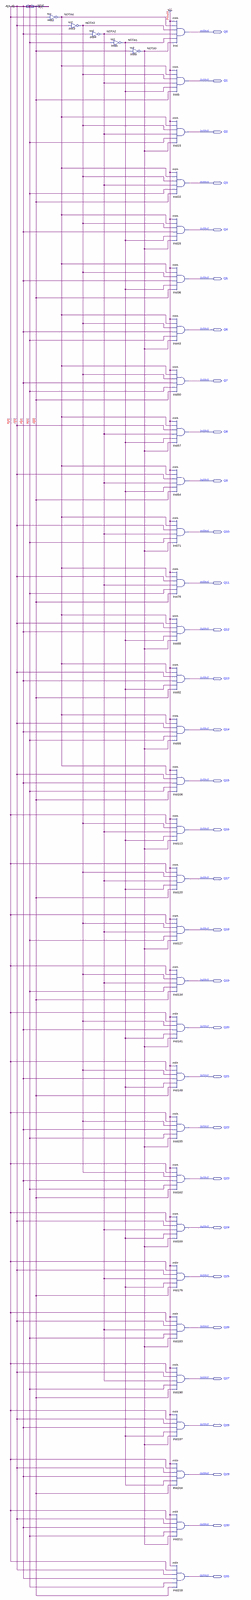
[diagram p0: schematic sheet, whole]
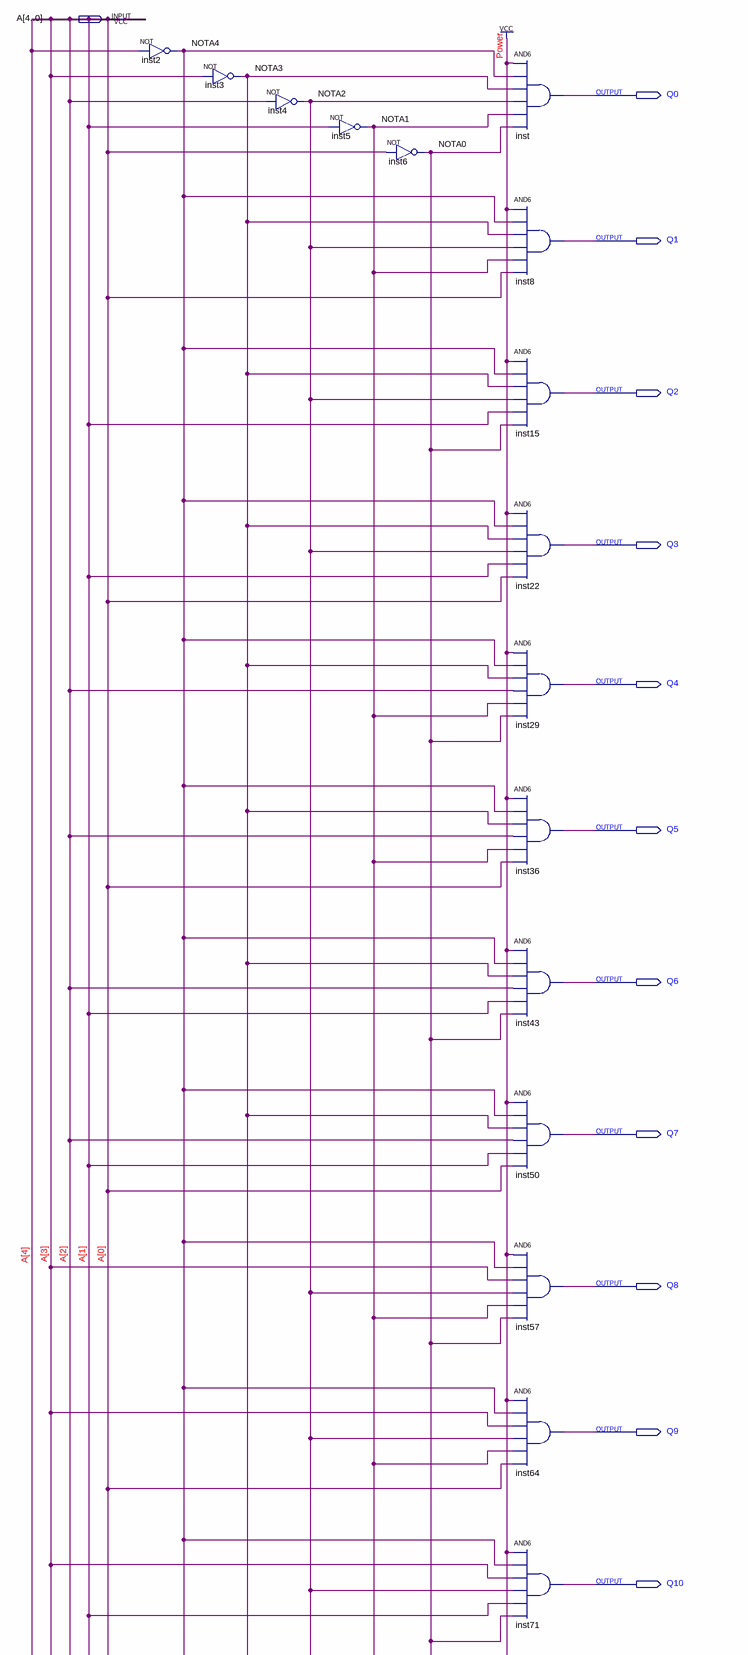
[diagram p1: schematic sheet, upper part]
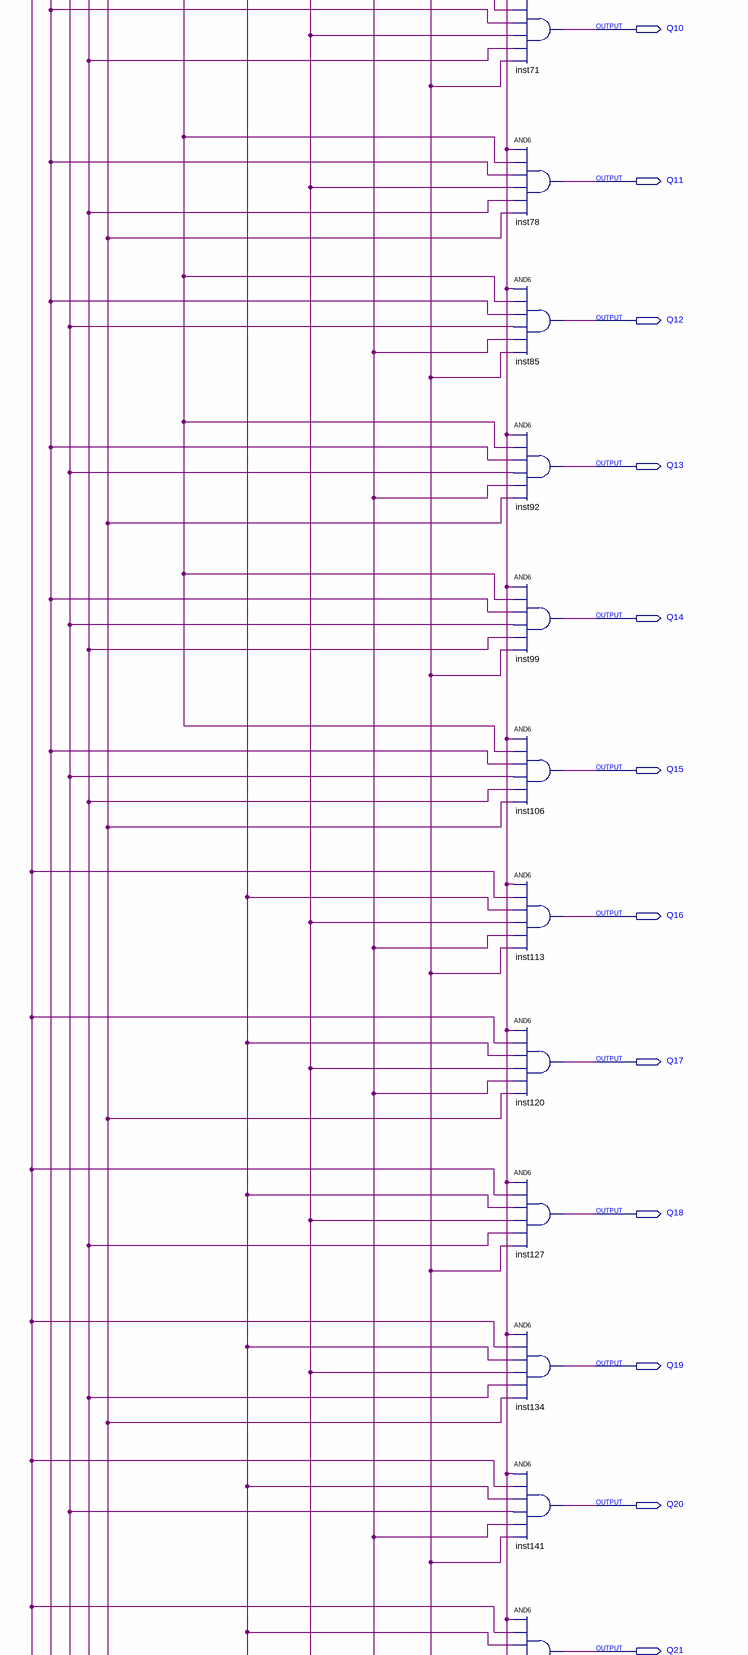
[diagram p2: schematic sheet, middle part]
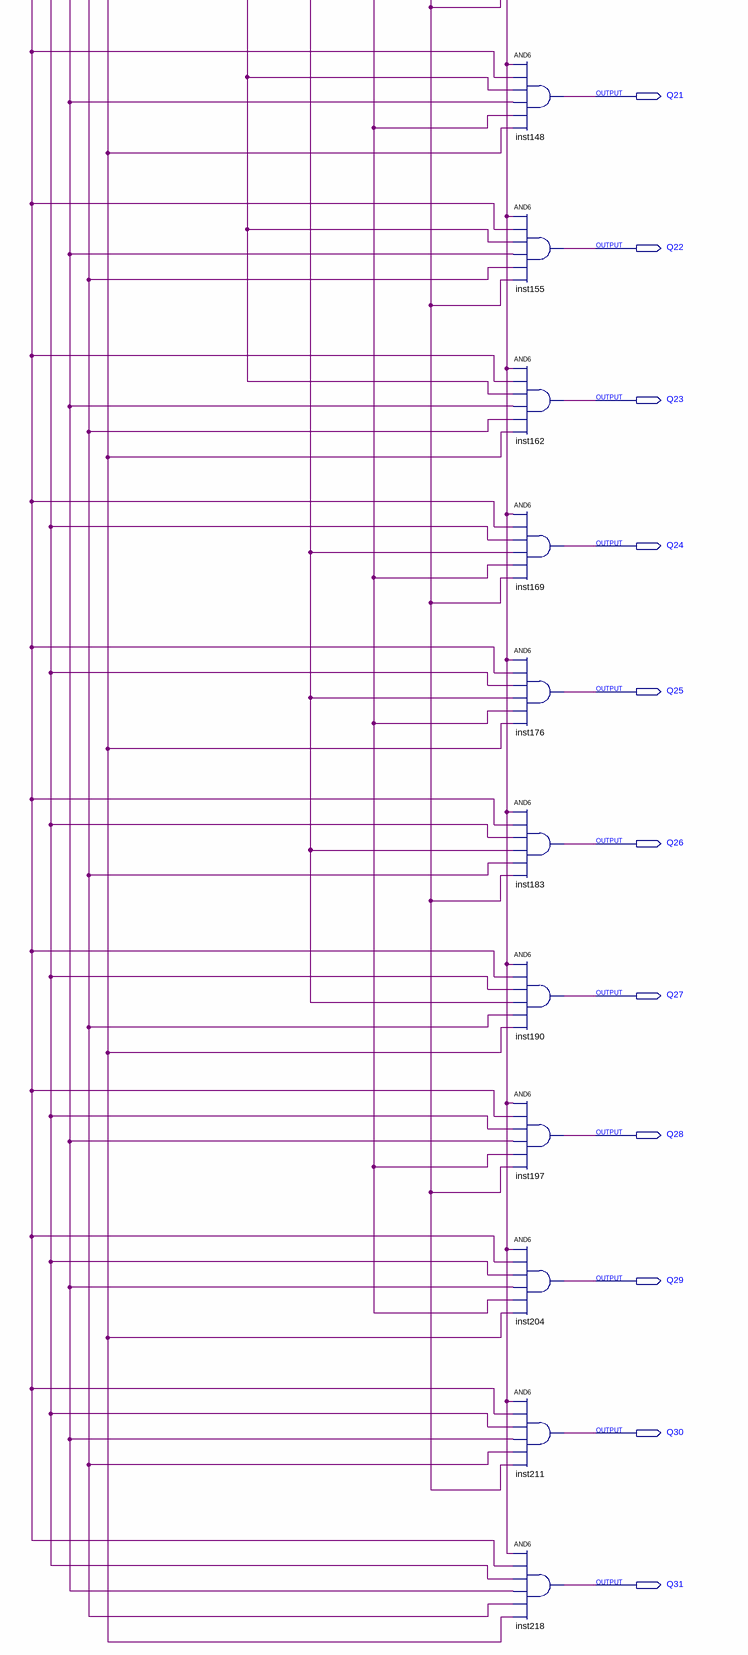
[diagram p3: schematic sheet, lower part]
// Quartus schematic Decoder_32.bdf as structural Verilog: 37 symbols, 33 pins
module Decoder_32 (
  input  [4:0] A,
  output Q0,
  output Q1,
  output Q2,
  output Q3,
  output Q4,
  output Q5,
  output Q6,
  output Q7,
  output Q8,
  output Q9,
  output Q10,
  output Q11,
  output Q12,
  output Q13,
  output Q14,
  output Q15,
  output Q16,
  output Q17,
  output Q18,
  output Q19,
  output Q20,
  output Q21,
  output Q22,
  output Q23,
  output Q24,
  output Q25,
  output Q26,
  output Q27,
  output Q28,
  output Q29,
  output Q30,
  output Q31
);

  wire NOTA0, NOTA1, NOTA2, NOTA3, NOTA4;

  not inst2 (NOTA4, A[4]);
  not inst3 (NOTA3, A[3]);
  not inst4 (NOTA2, A[2]);
  not inst5 (NOTA1, A[1]);
  not inst6 (NOTA0, A[0]);
  and inst (Q0, 1'b1, NOTA4, NOTA3, NOTA2, NOTA1, NOTA0);
  and inst8 (Q1, 1'b1, NOTA4, NOTA3, NOTA2, NOTA1, A[0]);
  and inst15 (Q2, 1'b1, NOTA4, NOTA3, NOTA2, A[1], NOTA0);
  and inst22 (Q3, 1'b1, NOTA4, NOTA3, NOTA2, A[1], A[0]);
  and inst29 (Q4, 1'b1, NOTA4, NOTA3, A[2], NOTA1, NOTA0);
  and inst36 (Q5, 1'b1, NOTA4, NOTA3, A[2], NOTA1, A[0]);
  and inst43 (Q6, 1'b1, NOTA4, NOTA3, A[2], A[1], NOTA0);
  and inst50 (Q7, 1'b1, NOTA4, NOTA3, A[2], A[1], A[0]);
  and inst57 (Q8, 1'b1, NOTA4, A[3], NOTA2, NOTA1, NOTA0);
  and inst64 (Q9, 1'b1, NOTA4, A[3], NOTA2, NOTA1, A[0]);
  and inst71 (Q10, 1'b1, NOTA4, A[3], NOTA2, A[1], NOTA0);
  and inst78 (Q11, 1'b1, NOTA4, A[3], NOTA2, A[1], A[0]);
  and inst85 (Q12, 1'b1, NOTA4, A[3], A[2], NOTA1, NOTA0);
  and inst92 (Q13, 1'b1, NOTA4, A[3], A[2], NOTA1, A[0]);
  and inst99 (Q14, 1'b1, NOTA4, A[3], A[2], A[1], NOTA0);
  and inst106 (Q15, 1'b1, NOTA4, A[3], A[2], A[1], A[0]);
  and inst113 (Q16, 1'b1, A[4], NOTA3, NOTA2, NOTA1, NOTA0);
  and inst120 (Q17, 1'b1, A[4], NOTA3, NOTA2, NOTA1, A[0]);
  and inst127 (Q18, 1'b1, A[4], NOTA3, NOTA2, A[1], NOTA0);
  and inst134 (Q19, 1'b1, A[4], NOTA3, NOTA2, A[1], A[0]);
  and inst141 (Q20, 1'b1, A[4], NOTA3, A[2], NOTA1, NOTA0);
  and inst148 (Q21, 1'b1, A[4], NOTA3, A[2], NOTA1, A[0]);
  and inst155 (Q22, 1'b1, A[4], NOTA3, A[2], A[1], NOTA0);
  and inst162 (Q23, 1'b1, A[4], NOTA3, A[2], A[1], A[0]);
  and inst169 (Q24, 1'b1, A[4], A[3], NOTA2, NOTA1, NOTA0);
  and inst176 (Q25, 1'b1, A[4], A[3], NOTA2, NOTA1, A[0]);
  and inst183 (Q26, 1'b1, A[4], A[3], NOTA2, A[1], NOTA0);
  and inst190 (Q27, 1'b1, A[4], A[3], NOTA2, A[1], A[0]);
  and inst197 (Q28, 1'b1, A[4], A[3], A[2], NOTA1, NOTA0);
  and inst204 (Q29, 1'b1, A[4], A[3], A[2], NOTA1, A[0]);
  and inst211 (Q30, 1'b1, A[4], A[3], A[2], A[1], NOTA0);
  and inst218 (Q31, 1'b1, A[4], A[3], A[2], A[1], A[0]);
endmodule
